# EasyEDA Pro project Cmod_Spartan7_board_2025-09-22.epro, schematic Schematic1
Board Name: Board1; Create Date: 2025-09-05; Page Name: P1; Project Name: Spartan7_Core; Schematic Name: Schematic1; Update Date: 2025-09-14; Company: 嘉立创EDA; Page Size: A4; Version: V1.0
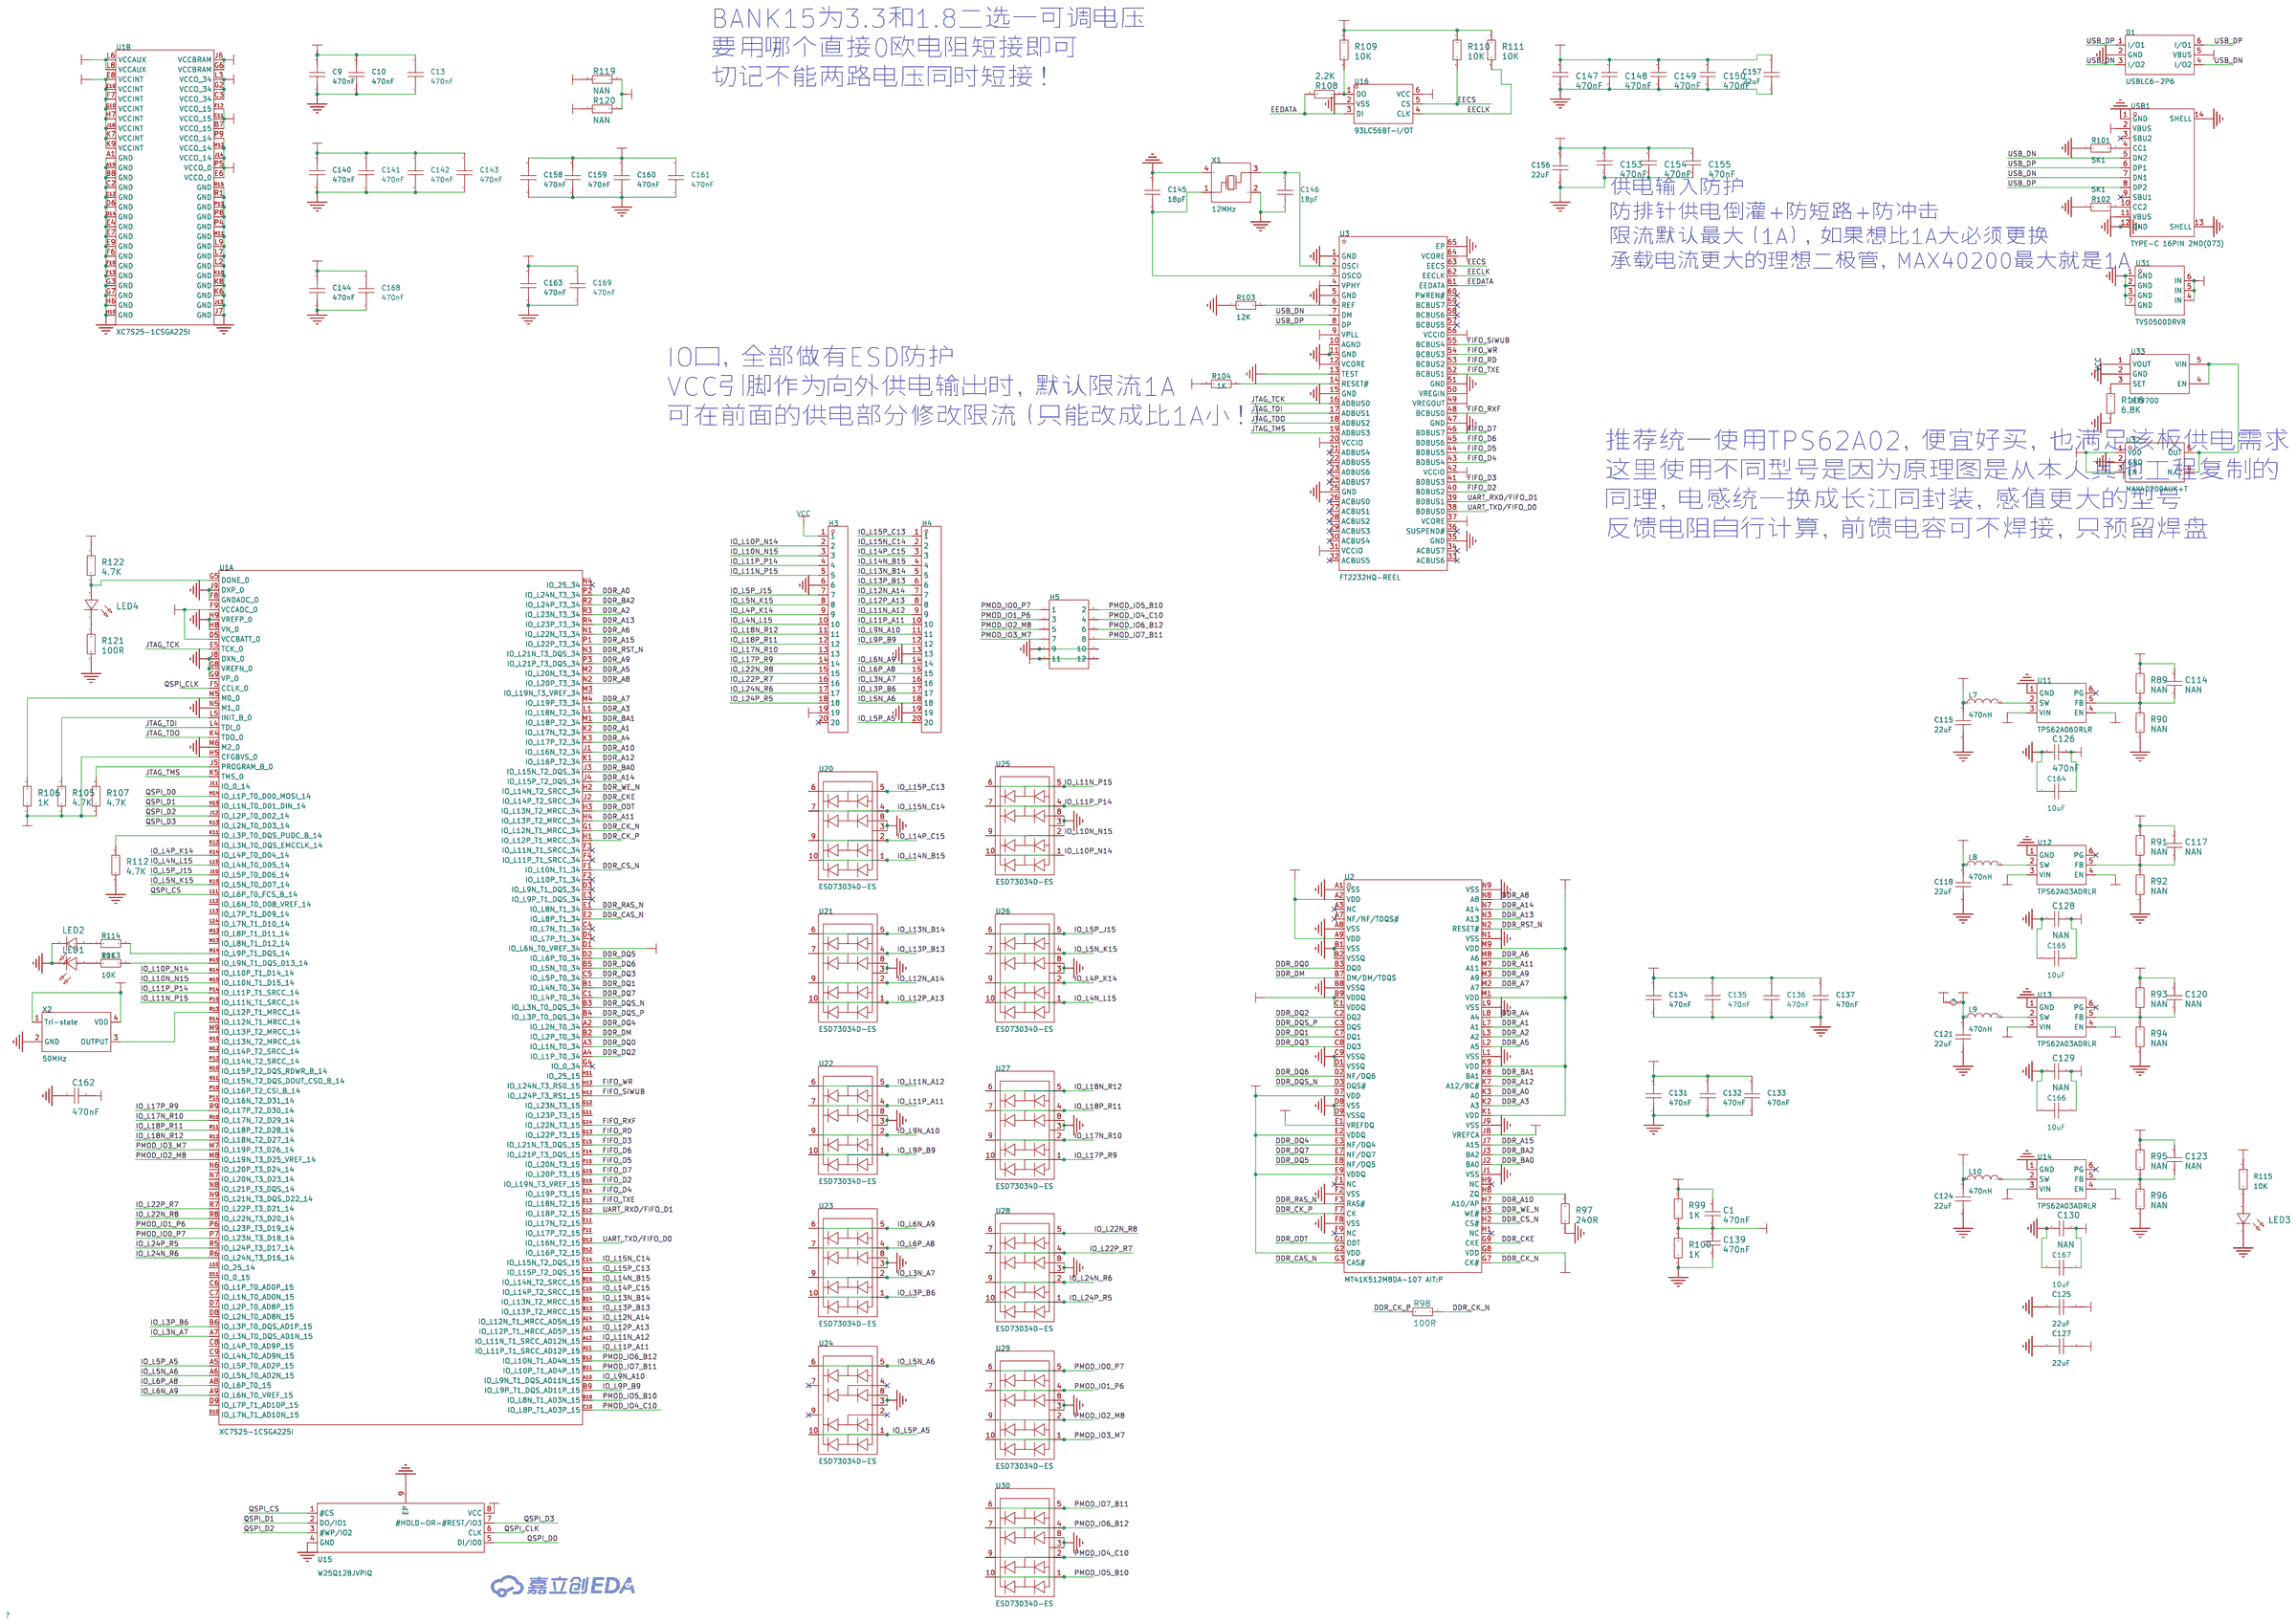
[diagram p0: schematic sheet]

## Parts
C1  470nF  [C_0402 COPY(1)]
C9  470nF  [C_0402 COPY(1)]
C10  470nF  [C_0402 COPY(1)]
C13  470nF  [C_0402 COPY(1)]
C114  NAN  [C_0402 COPY(1)]
C115  22uF  [C0603]
C117  NAN  [C_0402 COPY(1)]
C118  22uF  [C0603]
C120  NAN  [C_0402 COPY(1)]
C121  22uF  [C0603]
C123  NAN  [C_0402 COPY(1)]
C124  22uF  [C0603]
C125  22uF  [C0603]
C126  470nF  [C_0402 COPY(1)]
C127  22uF  [C0603]
C128  NAN  [C_0402 COPY(1)]
C129  NAN  [C_0402 COPY(1)]
C130  NAN  [C_0402 COPY(1)]
C131  470nF  [C_0402 COPY(1)]
C132  470nF  [C_0402 COPY(1)]
C133  470nF  [C_0402 COPY(1)]
C134  470nF  [C_0402 COPY(1)]
C135  470nF  [C_0402 COPY(1)]
C136  470nF  [C_0402 COPY(1)]
C137  470nF  [C_0402 COPY(1)]
C139  470nF  [C_0402 COPY(1)]
C140  470nF  [C_0402 COPY(1)]
C141  470nF  [C_0402 COPY(1)]
C142  470nF  [C_0402 COPY(1)]
C143  470nF  [C_0402 COPY(1)]
C144  470nF  [C_0402 COPY(1)]
C145  18pF  [C0603]
C146  18pF  [C0603]
C147  470nF  [C_0402 COPY(1)]
C148  470nF  [C_0402 COPY(1)]
C149  470nF  [C_0402 COPY(1)]
C150  470nF  [C_0402 COPY(1)]
C153  470nF  [C_0402 COPY(1)]
C154  470nF  [C_0402 COPY(1)]
C155  470nF  [C_0402 COPY(1)]
C156  22uF  [C0603]
C157  22uF  [C0603]
C158  470nF  [C_0402 COPY(1)]
C159  470nF  [C_0402 COPY(1)]
C160  470nF  [C_0402 COPY(1)]
C161  470nF  [C_0402 COPY(1)]
C162  470nF  [C_0402 COPY(1)]
C163  470nF  [C_0402 COPY(1)]
C164  10uF  [C0603]
C165  10uF  [C0603]
C166  10uF  [C0603]
C167  10uF  [C0603]
C168  470nF  [C_0402 COPY(1)]
C169  470nF  [C_0402 COPY(1)]
D1  USBLC6-2P6  [SOT-666-6_L1.6-W1.2-P0.50-LS1.6-BL]
H3  -  [HDR-TH_20P-P2.54-V-M-1]
H4  -  [HDR-TH_20P-P2.54-V-M-1]
H5  -  [HDR-TH_12P-P2.54-V-M-R2-C6-S2.54]
L7  470nH  [IND-SMD_L2.0-W1.6-B]
L8  470nH  [IND-SMD_L2.0-W1.6-B]
L9  470nH  [IND-SMD_L2.0-W1.6-B]
L10  470nH  [IND-SMD_L2.0-W1.6-B]
LED1  -  [LED_0603]
LED2  -  [LED_0603]
LED3  -  [LED_0603]
LED4  -  [LED_0603]
R89  NAN  [R_0402 COPY(1)]
R90  NAN  [R_0402 COPY(1)]
R91  NAN  [R_0402 COPY(1)]
R92  NAN  [R_0402 COPY(1)]
R93  NAN  [R_0402 COPY(1)]
R94  NAN  [R_0402 COPY(1)]
R95  NAN  [R_0402 COPY(1)]
R96  NAN  [R_0402 COPY(1)]
R97  240R  [R_0402 COPY(1)]
R98  100R  [R_0402 COPY(1)]
R99  1K  [R_0402 COPY(1)]
R100  1K  [R_0402 COPY(1)]
R101  5K1  [R0603]
R102  5K1  [R0603]
R103  12K  [R0603]
R104  1K  [R0603]
R105  4.7K  [R_0402 COPY(1)]
R106  1K  [R_0402 COPY(1)]
R107  4.7K  [R_0402 COPY(1)]
R108  2.2K  [R_0402 COPY(1)]
R109  10K  [R_0402 COPY(1)]
R110  10K  [R_0402 COPY(1)]
R111  10K  [R_0402 COPY(1)]
R112  4.7K  [R_0402 COPY(1)]
R113  10K  [R0603]
R114  10K  [R0603]
R115  10K  [R0603]
R116  6.8K  [R_0402 COPY(1)]
R119  NAN  [R_0402 COPY(1)]
R120  NAN  [R_0402 COPY(1)]
R121  100R  [R_0402 COPY(1)]
R122  4.7K  [R_0402 COPY(1)]
U1  XC7S25-1CSGA225I  [CSGA-225_L13.0-W13.0-R15-C15-P0.80-TL]  (sections 1,2)
U2  MT41K512M8DA-107 AIT:P  [FBGA-78_L10.5-W8.0-R13-C6-P0.80-TL]
U3  FT2232HQ-REEL  [QFN-64_L9.0-W9.0-P0.50-TL-EP4.3]
U11  TPS62A06DRLR  [SOT-563_L1.6-W1.2-P0.50-LS1.6-BR]
U12  TPS62A03ADRLR  [SOT-563_L1.6-W1.2-P0.50-LS1.6-BR]
U13  TPS62A03ADRLR  [SOT-563_L1.6-W1.2-P0.50-LS1.6-BR]
U14  TPS62A03ADRLR  [SOT-563_L1.6-W1.2-P0.50-LS1.6-BR]
U15  W25Q128JVPIQ  [WSON-8_L6.0-W5.0-P1.27-BL-EP]
U16  93LC56BT-I/OT  [SOT-23-6_L2.9-W1.6-P0.95-LS2.8-BR]
U20  ESD73034D-ES  [DFN2510-10_L2.5-W1.0-P0.50-BL]
U21  ESD73034D-ES  [DFN2510-10_L2.5-W1.0-P0.50-BL]
U22  ESD73034D-ES  [DFN2510-10_L2.5-W1.0-P0.50-BL]
U23  ESD73034D-ES  [DFN2510-10_L2.5-W1.0-P0.50-BL]
U24  ESD73034D-ES  [DFN2510-10_L2.5-W1.0-P0.50-BL]
U25  ESD73034D-ES  [DFN2510-10_L2.5-W1.0-P0.50-BL]
U26  ESD73034D-ES  [DFN2510-10_L2.5-W1.0-P0.50-BL]
U27  ESD73034D-ES  [DFN2510-10_L2.5-W1.0-P0.50-BL]
U28  ESD73034D-ES  [DFN2510-10_L2.5-W1.0-P0.50-BL]
U29  ESD73034D-ES  [DFN2510-10_L2.5-W1.0-P0.50-BL]
U30  ESD73034D-ES  [DFN2510-10_L2.5-W1.0-P0.50-BL]
U31  TVS0500DRVR  [WSON-6_L2.0-W2.0-P0.65-BL-EP]
U32  MAX40200AUK+T  [TSOT-23-5_L2.9-W1.6-P0.95-LS2.8-BL]
U33  MT9700  [SOT-23-5_L3.0-W1.7-P0.95-LS2.8-BR]
USB1  TYPE-C 16PIN 2MD(073)  [USB-C-SMD_TYPE-C-6PIN-2MD-073]
X1  12MHz  [CRYSTAL-SMD_4P-L3.2-W2.5-BL]
X2  50MHz  [OSC-SMD_4P-L3.2-W2.5-BL]

## Library data of the parts
C1 C114 C117 C120 C123 C126 C128-C130 C139 C147-C150 C153-C155 C162 = 10nF: Supplier: LCSC; Supplier Part: C76614; Manufacturer: TDK; Manufacturer Part: C1608X5R1E106MT000E
C9 C10 C13 C131-C137 C140-C144 C158-C161 C163 C168 C169 = CAP_0402: Supplier Footprint: 0402
C115 C118 C121 C124 C125 C127 C145 C146 C156 C157 C164-C167 = CAP_0603: Supplier Footprint: 0603
D1 = USBLC6-2P6_C2827693: 极性:单向;反向截止电压(Vrwm):5V;最大钳位电压:14V;峰值脉冲电流(Ipp):5.5A;峰值脉冲功率(Ppp):80W;击穿电压:6V;; LCSC Part Name: MSL=3; Supplier Part: C2827693; Manufacturer: TECH PUBLIC(台舟); Supplier Footprint: SOT-666-6; JLCPCB Part Class: 扩展库; Datasheet: https://atta.szlcsc.com/upload/public/pdf/source/20210810/36353A9194EA9F4E33F8AE18BE051AEA.pdf; Supplier: LCSC; polarity: 单向; Reverse Stand-Off Voltage (Vrwm): 5V; Maximum Clamping Voltage: 14V; Peak Pulse Current (Ipp): 5.5A; Peak Pulse Power Dissipation (Ppp): 80W; Breakdown Voltage: 6V; Reverse Leakage Current (Ir): 80nA; Number of Lines: 双路; Operating Temperature: -55℃~+125℃; level of protection: IEC 61000-4-2; Type: ESD
H3 H4 = HDR-M_2.54_1x20P: 间距:2.54mm;总PIN位数:20;排数:1;插针结构:-;行距:-;安装类型:直插;圆针/方针:-;额定电流:-;额定电压:-;配合针长度:-;塑高:-;触头材质:黄铜;触头镀层:-;颜色:黑色;; Supplier Part: C50981; Supplier Footprint: 插件
H5 = HDR-F_2.54_2x6
L7-L10 = FTC201612SR47MBCA: 电感值:470nH;精度:±20%;额定电流:6.7A;饱和电流(Isat):6.7A;类型:-;; LCSC Part Name: 470nH ±20% 6.7A; Supplier Part: C5832403; Manufacturer: cjiang(长江微电); Supplier Footprint: SMD,1.6x2mm; JLCPCB Part Class: 扩展库; Datasheet: https://atta.szlcsc.com/upload/public/pdf/source/20240918/5AD8A1A0D9C2859F32750FF2CC514AFA.pdf; Supplier: LCSC; Tolerance: ±20%; Current Rating: 6.7A; Current - Saturation(Isat): 6.7A; DC Resistance(DCR): 13mΩ
LED1-LED4 = LED_0603-R: Supplier Footprint: 0603
R89-R100 R105-R112 R116 R119-R122 = 80.6R  1%_R_0402 COPY: Supplier: LCSC; Manufacturer: WTC; Manufacturer Part: WR06X1001FTL; Supplier Part: C112433
R101-R104 R113-R115 = Res_0603: Supplier Footprint: 0603
U1 = XC7S25-1CSGA225I: LCSC Part Name: - XC7S25 1CSGA225I; Supplier Part: C1521710; Manufacturer: AMD/XILINX(赛灵思); Supplier Footprint: CSGA-225(13x13); JLCPCB Part Class: 扩展库; Datasheet: https://atta.szlcsc.com/upload/public/pdf/source/20210703/C1E6749F740AED67D29FCAB95332545E.pdf; Supplier: LCSC
U2 = MT41K512M8DA-107 AIT:P: 存储器构架(格式):SDRAM DDR3L;时钟频率(fc):-;存储容量:4Gbit;; Supplier Part: C1348756; Manufacturer: micron(镁光); Supplier Footprint: FBGA-78(8x10.5); JLCPCB Part Class: 扩展库; Datasheet: https://atta.szlcsc.com/upload/public/pdf/source/20210823/3BBDCC20C1D6BCF226EC39D08C0A3480.pdf; Supplier: LCSC; Memory Format: SDRAM DDR3L; Memory Size: 4Gbit; Voltage - Supply: 1.28V~1.45V; Current - Supply: 29mA; Refresh Current: 10mA; Operating Temperature: -40℃~+95℃
U3 = FT2232HQ-REEL: 应用功能:USB转UART；USB转FIFO;接口协议:-;; LCSC Part Name: FT2232H 双高速 USB 转多用途 UART/FIFO IC; Supplier Part: C193662; Manufacturer: FTDI(飞特帝亚); Supplier Footprint: QFN-64-EP(9x9); JLCPCB Part Class: 扩展库; Datasheet: https://atta.szlcsc.com/upload/public/pdf/source/20180530/C193662_F14B45A4B5271BE746E436B0F2E041EE.pdf; Supplier: LCSC; Applications Function: USB转UART；USB转FIFO; Supply Voltage: 3V~3.6V; Operating Temperature: -40℃~+85℃
U11 = TPS62A06DRLR: 功能类型:降压型;输出类型:-;工作电压:2.5V~5.5V;输出电压:-;输出电流:6A;; LCSC Part Name: 高效率同步降压转换器; Supplier Part: C22365365; Manufacturer: TI(德州仪器); Supplier Footprint: SOT-5X3-6; JLCPCB Part Class: 扩展库; Datasheet: https://atta.szlcsc.com/upload/public/pdf/source/20240321/41946EFE8F53C92CA8741079F1A5949F.pdf; Supplier: LCSC; Function: 降压型; Voltage - Supply: 2.5V~5.5V; Output Current: 6A; Frequency - Switching: 2.2MHz; Operating Temperature: -40℃~+125℃@(TJ); Synchronous Rectifier: 是; Number of Outputs: 1; Switch tube (built-in/external): 内置
U12-U14 = TPS62A03ADRLR: 功能类型:降压型;输出类型:可调;工作电压:2.5V~5.5V;输出电流:3A;; LCSC Part Name: 3A高效同步降压转换器; Supplier Part: C44545585; Manufacturer: TI(德州仪器); Supplier Footprint: SOT-563; JLCPCB Part Class: 扩展库; Datasheet: https://www.ti.com.cn/cn/lit/ds/symlink/tps62a03a.pdf; Supplier: LCSC; Function: 降压型; Output Type: 可调; Voltage - Supply: 2.5V~5.5V; Output Current: 3A; Frequency - Switching: 2.2MHz; Operating Temperature: -40℃~+125℃@(TJ); Synchronous Rectifier: 是; Number of Outputs: 1; Topology: 降压式; Quiescent Current: 28uA; Switch tube (built-in/external): 内置
U15 = W25Q128JVPIQ_C190862: 接口类型:SPI;存储容量:-;时钟频率(fc):133MHz;; LCSC Part Name: 支持双路/四路SPI接口的3V、128Mbit 串行闪存; Supplier Part: C190862; Manufacturer: Winbond(华邦); Supplier Footprint: WSON-8-EP(5x6); JLCPCB Part Class: 扩展库; Datasheet: https://item.szlcsc.com/datasheet/W25Q128JVPIQ/213201.html; Supplier: LCSC; Interface: SPI; Clock Frequency: 133MHz; Voltage - Supply: 2.7V~3.6V; Program / Erase Cycles: 100000次; Block Erase Time(tBE): 120ms@(32KB); Data Retention - TDR (Year): 20年
U16 = 93LC56BT-I/OT: 接口类型:SPI;存储容量:2Kbit;; Supplier Part: C190271; Manufacturer: MICROCHIP(美国微芯); Supplier Footprint: SOT-23-6; JLCPCB Part Class: 扩展库; Datasheet: https://atta.szlcsc.com/upload/public/pdf/source/20140724/1457707164359.pdf; Supplier: LCSC; Interface Type: SPI; Memory Size: 2Kbit; Supply Voltage: 2.5V~5.5V; Write Cycle Time (Tw): 6ms; Data Retention - TDR (Year): 200年; Write Cycle Endurance: 1000000次; Operating Temperature: -40℃~+85℃
U20-U30 = ESD73034D-ES: 极性:单向;反向截止电压(Vrwm):3.3V;钳位电压:7V;峰值脉冲电流(Ipp):8A;峰值脉冲功率(Ppp):120W;击穿电压:4V;; LCSC Part Name: 3.3/5.0V深回扫超低电容超低钳位4路双向ESD防护器件，7A、15kV、0.17pF；USB3.X/USB4.0/HDMI2.0/2.1等高速通讯防护。; Supplier Part: C19725108; Manufacturer: ElecSuper(静芯微); Supplier Footprint: DFN2510; JLCPCB Part Class: 扩展库; Datasheet: https://atta.szlcsc.com/upload/public/pdf/source/20250220/8ADBE6E42A56704D59DA91E6BDFBED0B.pdf; Supplier: LCSC; Polarity: 单向; Reverse Stand-Off Voltage (Vrwm): 3.3V; Clamping Voltage: 7V; Peak Pulse Current (Ipp): 8A; Peak Pulse Power Dissipation (Ppp): 120W; Voltage - Breakdown: 4V; Reverse Leakage Current (Ir): 1uA; Number of Channels: 四路; Type: ESD
U31 = TVS0500DRVR: 反向截止电压(Vrwm):5V;最大钳位电压:9.5V;峰值脉冲电流(Ipp)@10/1000us:-;峰值脉冲功率(Ppp)@10/1000us:400W;击穿电压:7.5V;; Supplier Part: C609571; Manufacturer: TI(德州仪器); Supplier Footprint: WSON-6(2x2); JLCPCB Part Class: 扩展库; Datasheet: https://www.ti.com/cn/lit/gpn/tvs0500; Supplier: LCSC; Reverse Stand-Off Voltage (Vrwm): 5V; Maximum Clamping Voltage: 9.5V; Peak Pulse Power Dissipation (Ppp)@10/1000us: 400W; Breakdown Voltage: 7.5V; Type: TVS
U32 = MAX40200AUK+T: 超小尺寸、微功耗、1A理想二极管，具有超低压降、电流开关/理想二极管节省空间，压降比肖特基二极管小10倍; LCSC Part Name: 超小型微功耗、1A理想二极管，具有超低电压降; Supplier Part: C2649430; Manufacturer: ADI(亚德诺)/MAXIM(美信); Supplier Footprint: SOT-23-5; JLCPCB Part Class: 扩展库; Datasheet: https://item.szlcsc.com/datasheet/MAX40200AUK%252BT/2741339.html; Supplier: LCSC
U33 = MT9700: 类型:高侧开关;通道数:1;输入控制逻辑:高电平有效;工作电压:2.4V~5.5V;; Supplier Part: C89855; Manufacturer: 西安航天民芯; Supplier Footprint: SOT-23-5; JLCPCB Part Class: 扩展库; Datasheet: https://item.szlcsc.com/datasheet/MT9700/91037.html; Supplier: LCSC; Type: 高侧开关; Number of Channels: 1; Control Input Logic: 高电平有效; Voltage - Supply: 2.4V~5.5V; Operating Temperature	-: -40℃~+85℃
USB1 = TYPE-C 16PIN 2MD(073): 连接器类型:Type-C;协议标准:-;公母:母;安装方式:卧贴;触点数量:16P;端口数量:1;额定电流 - 电源:3A;工作温度:-25℃~+85℃;; LCSC Part Name: Type-C 母 卧贴; Supplier Part: C2765186; Manufacturer: SHOU HAN(首韩); Supplier Footprint: SMD; JLCPCB Part Class: 扩展库; Datasheet: https://item.szlcsc.com/datasheet/TYPE-C%252016PIN%25202MD(073)/2901843.html; Supplier: LCSC; Connector Type: Type-C; Gender: 母; Mounting Type: 卧贴; Number of Contacts: 16P; Number of Ports: 1; Current Rating-Power: 3A; Voltage Rating: 5V; Connect-Disconnect Life: 5千次; Detection color: 黑色; Operating Temperature: -25℃~+85℃
X1 = X322512MSB4SI: 晶振类型:贴片晶振;频率:12MHz;常温频差:±10ppm;负载电容:20pF;频率稳定度:±20ppm;; LCSC Part Name: YSX321SL 12MHZ 4P 3225 20PF ±10PPM -40~85℃ (±20PPM); Supplier Part: C9002; Manufacturer: YXC(扬兴晶振); Supplier Footprint: SMD3225-4P; JLCPCB Part Class: 基础库; Datasheet: https://item.szlcsc.com/datasheet/X322512MSB4SI/9522.html; Supplier: LCSC; Type: 贴片晶振; Normal temperature Frequency Tolerance: ±10ppm; Load Capacitance: 20pF; Frequency Stability: ±20ppm; Operating Temperature: -40℃~+85℃
X2 = OT322550MJBA4SL: 频率:50MHz;常温频差:±10ppm;输出模式:CMOS;工作电压:1.8V~3.3V;频率稳定度:±20ppm;; LCSC Part Name: YSO110TR 50MHZ 4P 3225 1.8V-3.3V ±10PPM -40~85℃ (±20PPM) CMOS; Supplier Part: C717684; Manufacturer: YXC(扬兴晶振); Supplier Footprint: SMD3225-4P; JLCPCB Part Class: 扩展库; Datasheet: https://atta.szlcsc.com/upload/public/pdf/source/20240731/596E5F7673E50DA744B7F79F139FB8DF.pdf; Supplier: LCSC; Normal temperature Frequency Tolerance: ±10ppm; Output Type: CMOS; Voltage - Supply: 1.8V~3.3V; Frequency Stability: ±20ppm; Operating Temperature: -40℃~+85℃

## Nets
1V0: C114.2 C115.2 C140.2 C141.2 C142.2 C143.2 L7.1 R89.2 U1.E8(VCCINT) U1.E10(VCCINT) U1.F7(VCCINT) U1.G6(VCCBRAM) U1.G10(VCCINT) U1.H7(VCCINT) U1.J6(VCCBRAM) U1.J10(VCCINT) U1.K7(VCCINT) U1.K9(VCCINT)
1V8: C117.2 C118.2 C144.2 C168.2 L8.1 R91.2 R119.2 U1.D5(VCCBATT_0) U1.F9(VCCADC_0) U1.L6(VCCAUX) U1.L8(VCCAUX)
3V3: C123.2 C124.2 C147.1 C148.1 C149.1 C150.1 C157.2 C158.2 C159.2 C160.2 C161.2 C162.2 H3.19 H5.11 H5.12 L10.1 R95.2 R104.1 R105.1 R106.1 R107.1 R109.1 R110.1 R111.1 R115.2 R120.2 R122.1 U1.E6(VCCO_0) U1.H5(CFGBVS_0) U1.J14(VCCO_14) U1.M12(VCCO_14) U1.P5(VCCO_0) U1.P9(VCCO_14) U3.4(VPHY) U3.9(VPLL) U3.20(VCCIO) U3.31(VCCIO) U3.42(VCCIO) U3.50(VREGIN) U3.56(VCCIO) U15.8(VCC) U16.6(VCC) X2.1(Tri-state) X2.4(VDD)
+1V5: C1.2 C9.2 C10.2 C13.2 C120.2 C121.2 C134.2 C135.2 C136.2 C137.2 L9.1 R93.2 R99.2 U1.C3(VCCO_34) U1.G2(VCCO_34) U1.L3(VCCO_34) U2.A2(VDD) U2.A9(VDD) U2.B9(VDDQ) U2.C1(VDDQ) U2.D7(VDD) U2.E2(VDDQ) U2.E9(VDDQ) U2.G2(VDD) U2.G8(VDD) U2.K1(VDD) U2.K9(VDD) U2.M1(VDD) U2.M9(VDD)
GND: C9.1 C10.1 C13.1 C115.1 C118.1 C121.1 C124.1 C125.2 C126.2 C127.2 C128.2 C129.2 C130.2 C131.1 C132.1 C133.1 C134.1 C135.1 C136.1 C137.1 C139.1 C140.1 C141.1 C142.1 C143.1 C144.1 C145.2 C146.1 C147.2 C148.2 C149.2 C150.2 C153.2 C154.2 C155.2 C156.1 C157.1 C158.1 C159.1 C160.1 C161.1 C162.1 C163.1 C164.2 C165.2 C166.2 C167.2 C168.1 C169.1 D1.2(GND) H3.6 H4.13 H4.19 H5.9 H5.10 LED1.1(C) LED2.1(C) LED3.1(C) R90.1 R92.1 R94.1 R96.1 R97.1 R100.1 R101.1 R102.1 R103.1 R112.1 R116.1 R121.2 U1.A1(GND) U1.A15(GND) U1.B8(GND) U1.C2(GND) U1.C12(GND) U1.D6(GND) U1.D14(GND) U1.E4(GND) U1.E7(GND) U1.E9(GND) U1.F6(GND) U1.F8(GNDADC_0) U1.F10(GND) U1.F13(GND) U1.G3(GND) U1.G7(GND) U1.G8(VREFN_0) U1.G9(VP_0) U1.H6(GND) U1.H8(VN_0) U1.H9(VREFP_0) U1.H10(GND) U1.J7(GND) U1.J8(DXN_0) U1.J9(DXP_0) U1.J13(GND) U1.K6(GND) U1.K8(GND) U1.K10(GND) U1.L2(GND) U1.L7(GND) U1.L9(GND) U1.M6(M2_0) U1.M11(GND) U1.N5(M1_0) U1.P4(GND) U1.P8(GND) U1.P13(GND) U1.R1(GND) U1.R15(GND) U2.A1(VSS) U2.A8(VSS) U2.B1(VSS) U2.B2(VSSQ) U2.B8(VSSQ) U2.C9(VSSQ) U2.D1(VSSQ) U2.D8(VSS) U2.D9(VSSQ) U2.F2(VSS) U2.F8(VSS) U2.J1(VSS) U2.J9(VSS) U2.L1(VSS) U2.L9(VSS) U2.N1(VSS) U2.N9(VSS) U3.1(GND) U3.5(GND) U3.10(AGND) U3.11(GND) U3.13(TEST) U3.15(GND) U3.25(GND) U3.35(GND) U3.47(GND) U3.51(GND) U3.65(EP) U11.1(GND) U12.1(GND) U13.1(GND) U14.1(GND) U15.4(GND) U15.9(EP) U16.2(VSS) U20.3 U20.8 U21.3 U21.8 U22.3 U22.8 U23.3 U23.8 U24.3 U24.8 U25.3 U25.8 U26.3 U26.8 U27.3 U27.8 U28.3 U28.8 U29.3 U29.8 U30.3 U30.8 U31.1(GND) U31.2(GND) U31.3(GND) U31.7(GND) U32.2(GND) U33.2(GND) USB1.1(GND) USB1.12(GND) USB1.13(SHELL) USB1.14(SHELL) X1.2(GND) X1.4(GND) X2.2(GND)
VCC: C126.1 C128.1 C129.1 C130.1 C164.1 C165.1 C166.1 C167.1 H3.1 U11.3(VIN) U11.4(EN) U12.3(VIN) U12.4(EN) U13.3(VIN) U13.4(EN) U14.3(VIN) U14.4(EN) U33.1(VOUT)
VCCIO_ADJ: C163.2 C169.2 R119.1 R120.1 U1.B7(VCCO_15) U1.C11(VCCO_15) U1.F12(VCCO_15)
DDR_A0: U1.P2(IO_L24N_T3_34) U2.K3(A0)
DDR_A1: U1.K2(IO_L17N_T2_34) U2.L7(A1)
DDR_A2: U1.R3(IO_L23N_T3_34) U2.L3(A2)
DDR_A3: U1.L1(IO_L18N_T2_34) U2.K2(A3)
DDR_A4: U1.K3(IO_L17P_T2_34) U2.L8(A4)
DDR_A5: U1.M2(IO_L20N_T3_34) U2.L2(A5)
DDR_A6: U1.N1(IO_L22N_T3_34) U2.M8(A6)
DDR_A7: U1.M4(IO_L19P_T3_34) U2.M2(A7)
DDR_A8: U1.N2(IO_L20P_T3_34) U2.N8(A8)
DDR_A9: U1.P3(IO_L21P_T3_DQS_34) U2.M3(A9)
DDR_A10: U1.J1(IO_L16N_T2_34) U2.H7(A10/AP)
DDR_A11: U1.H4(IO_L13P_T2_MRCC_34) U2.M7(A11)
DDR_A12: U1.K1(IO_L16P_T2_34) U2.K7(A12/BC#)
DDR_A13: U1.R4(IO_L23P_T3_34) U2.N3(A13)
DDR_A14: U1.J4(IO_L15P_T2_DQS_34) U2.N7(A14)
DDR_A15: U1.P1(IO_L22P_T3_34) U2.J7(A15)
DDR_BA0: U1.J3(IO_L15N_T2_DQS_34) U2.J2(BA0)
DDR_BA1: U1.M1(IO_L18P_T2_34) U2.K8(BA1)
DDR_BA2: U1.R2(IO_L24P_T3_34) U2.J3(BA2)
DDR_CAS_N: U1.E2(IO_L8P_T1_34) U2.G3(CAS#)
DDR_CK_N: R98.1 U1.G1(IO_L12N_T1_MRCC_34) U2.G7(CK#)
DDR_CK_P: R98.2 U1.H1(IO_L12P_T1_MRCC_34) U2.F7(CK)
DDR_CKE: U1.J2(IO_L14P_T2_SRCC_34) U2.G9(CKE)
DDR_CS_N: U1.F1(IO_L10N_T1_34) U2.H2(CS#)
DDR_DM: U1.B2(IO_L2P_T0_34) U2.B7(DM/DM/TDQS)
DDR_DQ0: U1.A3(IO_L1N_T0_34) U2.B3(DQ0)
DDR_DQ1: U1.B1(IO_L4N_T0_34) U2.C7(DQ1)
DDR_DQ2: U1.A4(IO_L1P_T0_34) U2.C2(DQ2)
DDR_DQ3: U1.C5(IO_L5P_T0_34) U2.C8(DQ3)
DDR_DQ4: U1.A2(IO_L2N_T0_34) U2.E3(NF/DQ4)
DDR_DQ5: U1.D2(IO_L6P_T0_34) U2.E8(NF/DQ5)
DDR_DQ6: U1.B5(IO_L5N_T0_34) U2.D2(NF/DQ6)
DDR_DQ7: U1.C1(IO_L4P_T0_34) U2.E7(NF/DQ7)
DDR_DQS_N: U1.B3(IO_L3N_T0_DQS_34) U2.D3(DQS#)
DDR_DQS_P: U1.B4(IO_L3P_T0_DQS_34) U2.C3(DQS)
DDR_ODT: U1.H3(IO_L13N_T2_MRCC_34) U2.G1(ODT)
DDR_RAS_N: U1.E1(IO_L8N_T1_34) U2.F3(RAS#)
DDR_RST_N: U1.N3(IO_L21N_T3_DQS_34) U2.N2(RESET#)
DDR_VREF: C1.1 C131.2 C132.2 C133.2 C139.2 R99.1 R100.2 U1.D1(IO_L6N_T0_VREF_34) U2.E1(VREFDQ) U2.J8(VREFCA)
DDR_WE_N: U1.H2(IO_L14N_T2_SRCC_34) U2.H3(WE#)
EECLK: R111.2 U3.62(EECLK) U16.4(CLK)
EECS: R110.2 U3.63(EECS) U16.5(CS)
EEDATA: R108.2 U3.61(EEDATA) U16.3(DI)
FIFO_D2: U1.D15(IO_L19N_T3_VREF_15) U3.40(BDBUS2)
FIFO_D3: U1.E15(IO_L21N_T3_DQS_15) U3.41(BDBUS3)
FIFO_D4: U1.E14(IO_L19P_T3_15) U3.43(BDBUS4)
FIFO_D5: U1.F15(IO_L20N_T3_15) U3.44(BDBUS5)
FIFO_D6: U1.F14(IO_L21P_T3_DQS_15) U3.45(BDBUS6)
FIFO_D7: U1.G15(IO_L20P_T3_15) U3.46(BDBUS7)
FIFO_RD: U1.G13(IO_L22P_T3_15) U3.53(BCBUS2)
FIFO_RXF: U1.G14(IO_L22N_T3_15) U3.48(BCBUS0)
FIFO_SIWUB: U1.H12(IO_L24P_T3_RS1_15) U3.55(BCBUS4)
FIFO_TXE: U1.E13(IO_L18N_T2_15) U3.52(BCBUS1)
FIFO_WR: U1.H13(IO_L24N_T3_RS0_15) U3.54(BCBUS3)
FT_1V8: C153.1 C154.1 C155.1 C156.2 U3.12(VCORE) U3.37(VCORE) U3.49(VREGOUT) U3.64(VCORE)
IO_L3N_A7: H4.16 U1.A7(IO_L3N_T0_DQS_AD1N_15) U23.2 U23.9
IO_L3P_B6: H4.17 U1.B6(IO_L3P_T0_DQS_AD1P_15) U23.1 U23.10
IO_L4N_L15: H3.10 U1.L15(IO_L4N_T0_D05_14) U26.1 U26.10
IO_L4P_K14: H3.9 U1.K14(IO_L4P_T0_D04_14) U26.2 U26.9
IO_L5N_A6: H4.18 U1.A6(IO_L5N_T0_AD2N_15) U24.5 U24.6
IO_L5N_K15: H3.8 U1.K15(IO_L5N_T0_D07_14) U26.4 U26.7
IO_L5P_A5: H4.20 U1.A5(IO_L5P_T0_AD2P_15) U24.1 U24.10
IO_L5P_J15: H3.7 U1.J15(IO_L5P_T0_D06_14) U26.5 U26.6
IO_L6N_A9: H4.14 U1.A9(IO_L6N_T0_VREF_15) U23.5 U23.6
IO_L6P_A8: H4.15 U1.A8(IO_L6P_T0_15) U23.4 U23.7
IO_L9N_A10: H4.11 U1.A10(IO_L9N_T1_DQS_AD11N_15) U22.2 U22.9
IO_L9P_B9: H4.12 U1.B9(IO_L9P_T1_DQS_AD11P_15) U22.1 U22.10
IO_L10N_N15: H3.3 U1.N15(IO_L10N_T1_D15_14) U25.2 U25.9
IO_L10P_N14: H3.2 U1.N14(IO_L10P_T1_D14_14) U25.1 U25.10
IO_L11N_A12: H4.9 U1.A12(IO_L11N_T1_SRCC_AD12N_15) U22.5 U22.6
IO_L11N_P15: H3.5 U1.P15(IO_L11N_T1_SRCC_14) U25.5 U25.6
IO_L11P_A11: H4.10 U1.A11(IO_L11P_T1_SRCC_AD12P_15) U22.4 U22.7
IO_L11P_P14: H3.4 U1.P14(IO_L11P_T1_SRCC_14) U25.4 U25.7
IO_L12N_A14: H4.7 U1.A14(IO_L12N_T1_MRCC_AD5N_15) U21.2 U21.9
IO_L12P_A13: H4.8 U1.A13(IO_L12P_T1_MRCC_AD5P_15) U21.1 U21.10
IO_L13N_B14: H4.5 U1.B14(IO_L13N_T2_MRCC_15) U21.5 U21.6
IO_L13P_B13: H4.6 U1.B13(IO_L13P_T2_MRCC_15) U21.4 U21.7
IO_L14N_B15: H4.4 U1.B15(IO_L14N_T2_SRCC_15) U20.1 U20.10
IO_L14P_C15: H4.3 U1.C15(IO_L14P_T2_SRCC_15) U20.2 U20.9
IO_L15N_C14: H4.2 U1.C14(IO_L15N_T2_DQS_15) U20.4 U20.7
IO_L15P_C13: H4.1 U1.C13(IO_L15P_T2_DQS_15) U20.5 U20.6
IO_L17N_R10: H3.13 U1.R10(IO_L17N_T2_D29_14) U27.2 U27.9
IO_L17P_R9: H3.14 U1.R9(IO_L17P_T2_D30_14) U27.1 U27.10
IO_L18N_R12: H3.11 U1.R12(IO_L18N_T2_D27_14) U27.5 U27.6
IO_L18P_R11: H3.12 U1.R11(IO_L18P_T2_D28_14) U27.4 U27.7
IO_L22N_R8: H3.15 U1.R8(IO_L22N_T3_D20_14) U28.5 U28.6
IO_L22P_R7: H3.16 U1.R7(IO_L22P_T3_D21_14) U28.4 U28.7
IO_L24N_R6: H3.17 U1.R6(IO_L24N_T3_D16_14) U28.2 U28.9
IO_L24P_R5: H3.18 U1.R5(IO_L24P_T3_D17_14) U28.1 U28.10
JTAG_TCK: U1.E5(TCK_0) U3.16(ADBUS0)
JTAG_TDI: U1.L4(TDI_0) U3.17(ADBUS1)
JTAG_TDO: U1.K4(TDO_0) U3.18(ADBUS2)
JTAG_TMS: U1.K5(TMS_0) U3.19(ADBUS3)
PMOD_IO0_P7: H5.1 U1.P7(IO_L23N_T3_D18_14) U29.5 U29.6
PMOD_IO1_P6: H5.3 U1.P6(IO_L23P_T3_D19_14) U29.4 U29.7
PMOD_IO2_M8: H5.5 U1.M8(IO_L19N_T3_D25_VREF_14) U29.2 U29.9
PMOD_IO3_M7: H5.7 U1.M7(IO_L19P_T3_D26_14) U29.1 U29.10
PMOD_IO4_C10: H5.4 U1.C10(IO_L8P_T1_AD3P_15) U30.2 U30.9
PMOD_IO5_B10: H5.2 U1.B10(IO_L8N_T1_AD3N_15) U30.1 U30.10
PMOD_IO6_B12: H5.6 U1.B12(IO_L10N_T1_AD4N_15) U30.4 U30.7
PMOD_IO7_B11: H5.8 U1.B11(IO_L10P_T1_AD4P_15) U30.5 U30.6
QSPI_CLK: U1.F5(CCLK_0) U15.6(CLK)
QSPI_CS: U1.L11(IO_L6P_T0_FCS_B_14) U15.1(#CS)
QSPI_D0: U1.H14(IO_L1P_T0_D00_MOSI_14) U15.5(DI/IO0)
QSPI_D1: U1.H15(IO_L1N_T0_D01_DIN_14) U15.2(DO/IO1)
QSPI_D2: U1.J12(IO_L2P_T0_D02_14) U15.3(#WP/IO2)
QSPI_D3: U1.K13(IO_L2N_T0_D03_14) U15.7(#HOLD-OR-#REST/IO3)
UART_RXD/FIFO_D1: U1.E12(IO_L18P_T2_15) U3.39(BDBUS1)
UART_TXD/FIFO_D0: U1.D13(IO_L16N_T2_15) U3.38(BDBUS0)
USB_DN: D1.3(I/O2) D1.4(I/O2) U3.7(DM) USB1.5(DN2) USB1.7(DN1)
USB_DP: D1.1(I/O1) D1.6(I/O1) U3.8(DP) USB1.6(DP1) USB1.8(DP2)
USB_VBUS: C125.1 C127.1 D1.5(VBUS) U31.4(IN) U31.5(IN) U31.6(IN) U32.1(VDD) U32.3(EN) USB1.2(VBUS) USB1.11(VBUS)
$1N2196: R97.2 U2.H8(ZQ)
$1N5793: L9.2 U13.2(SW)
$1N5798: C120.1 R93.1 R94.2 U13.5(FB)
$1N5803: C117.1 R91.1 R92.2 U12.5(FB)
$1N5805: L8.2 U12.2(SW)
$1N5813: C123.1 R95.1 R96.2 U14.5(FB)
$1N5821: L10.2 U14.2(SW)
$1N5828: L7.2 U11.2(SW)
$1N5831: C114.1 R89.1 R90.2 U11.5(FB)
$1N11643: R101.2 USB1.4(CC1)
$1N11669: R102.2 USB1.10(CC2)
$1N12333: R103.2 U3.6(REF)
$1N12378: R104.2 U3.14(RESET#)
$1N12523: C145.1 U3.3(OSCO) X1.1(OSC1)
$1N12537: C146.2 U3.2(OSCI) X1.3(OSC2)
$1N13110: R106.2 U1.M5(M0_0)
$1N13120: R105.2 U1.L5(INIT_B_0)
$1N13124: R107.2 U1.J5(PROGRAM_B_0)
$1N13439: R108.1 R109.2 U16.1(DO)
$1N13700: R112.2 U1.K11(IO_L3P_T0_DQS_PUDC_B_14)
$1N13876: U1.R13(IO_L12P_T1_MRCC_14) X2.3(OUTPUT)
$1N22033: LED1.2(A) R113.1
$1N22061: R113.2 U1.M15(IO_L9N_T1_DQS_D13_14)
$1N22145: LED2.2(A) R114.1
$1N22149: R114.2 U1.M14(IO_L9P_T1_DQS_14)
$1N22209: LED3.2(A) R115.1
$1N22459: U32.4(N.C.) U32.5(OUT) U33.4(EN) U33.5(VIN)
$1N22640: R116.2 U33.3(SET)
$1N32609: LED4.1(C) R121.1
$1N32637: LED4.2(A) R122.2 U1.G5(DONE_0)

Not connected (* = marked no-connect by the designer): H3 20*; U1 C4(IO_L7N_T1_34)* C6(IO_L1P_T0_AD0P_15) C7(IO_L1N_T0_AD0N_15) C8(IO_L4P_T0_AD9P_15) C9(IO_L4N_T0_AD9N_15) D3(IO_L9N_T1_DQS_34)* D4(IO_L7P_T1_34)* D7(IO_L2P_T0_AD8P_15) D8(IO_L2N_T0_AD8N_15) D9(IO_L7P_T1_AD10P_15) D10(IO_L7N_T1_AD10N_15) D11(IO_0_15) D12(IO_L16P_T2_15) E3(IO_L9P_T1_DQS_34)* E11(IO_L17N_T2_15) F2(IO_L10P_T1_34)* F3(IO_L11N_T1_SRCC_34)* F4(IO_L11P_T1_SRCC_34)* F11(IO_L17P_T2_15) G4(IO_0_34)* G11(IO_L23P_T3_15) G12(IO_L23N_T3_15) H11(IO_25_15) J11(IO_0_14) K12(IO_L3N_T0_DQS_EMCCLK_14) L10(IO_25_14) L12(IO_L6N_T0_D08_VREF_14) L13(IO_L7P_T1_D09_14) L14(IO_L7N_T1_D10_14) M3(IO_L19N_T3_VREF_34) M9(IO_L13P_T2_MRCC_14) M10(IO_L13N_T2_MRCC_14) M13(IO_L8P_T1_D11_14) N4(IO_25_34)* N6(IO_L20P_T3_D24_14) N7(IO_L20N_T3_D23_14) N8(IO_L21P_T3_DQS_14) N9(IO_L21N_T3_DQS_D22_14) N10(IO_L15P_T2_DQS_RDWR_B_14) N11(IO_L15N_T2_DQS_DOUT_CSO_B_14) N12(IO_L14P_T2_SRCC_14) N13(IO_L8N_T1_D12_14) P10(IO_L16P_T2_CSI_B_14) P11(IO_L16N_T2_D31_14) P12(IO_L14N_T2_SRCC_14) R14(IO_L12N_T1_MRCC_14); U2 A3(NC)* A7(NF/NF/TDQS#)* F1(NC)* F9(NC)* H1(NC)* H9(NC)*; U3 21(ADBUS4)* 22(ADBUS5)* 23(ADBUS6)* 24(ADBUS7)* 26(ACBUS0)* 27(ACBUS1)* 28(ACBUS2)* 29(ACBUS3)* 30(ACBUS4)* 32(ACBUS5)* 33(ACBUS6)* 34(ACBUS7)* 36(SUSPEND#)* 57(BCBUS5)* 58(BCBUS6)* 59(BCBUS7)* 60(PWREN#)*; U11 6(PG)*; U12 6(PG)*; U13 6(PG)*; U14 6(PG)*; U24 2* 4* 7* 9*; USB1 3(SBU2)* 9(SBU1)*

## Notes on the sheet
- BANK15为3.3和1.8二选一可调电压
  要用哪个直接0欧电阻短接即可
  切记不能两路电压同时短接！
- 供电输入防护
  防排针供电倒灌+防短路+防冲击
  限流默认最大（1A），如果想比1A大必须更换
  承载电流更大的理想二极管，MAX40200最大就是1A
- IO口，全部做有ESD防护
  VCC引脚作为向外供电输出时，默认限流1A
  可在前面的供电部分修改限流（只能改成比1A小！）
- 推荐统一使用TPS62A02，便宜好买，也满足该板供电需求
  这里使用不同型号是因为原理图是从本人其他工程复制的
  同理，电感统一换成长江同封装，感值更大的型号
  反馈电阻自行计算，前馈电容可不焊接，只预留焊盘
